# EAGLE design PointController (EAGLE 6.1)
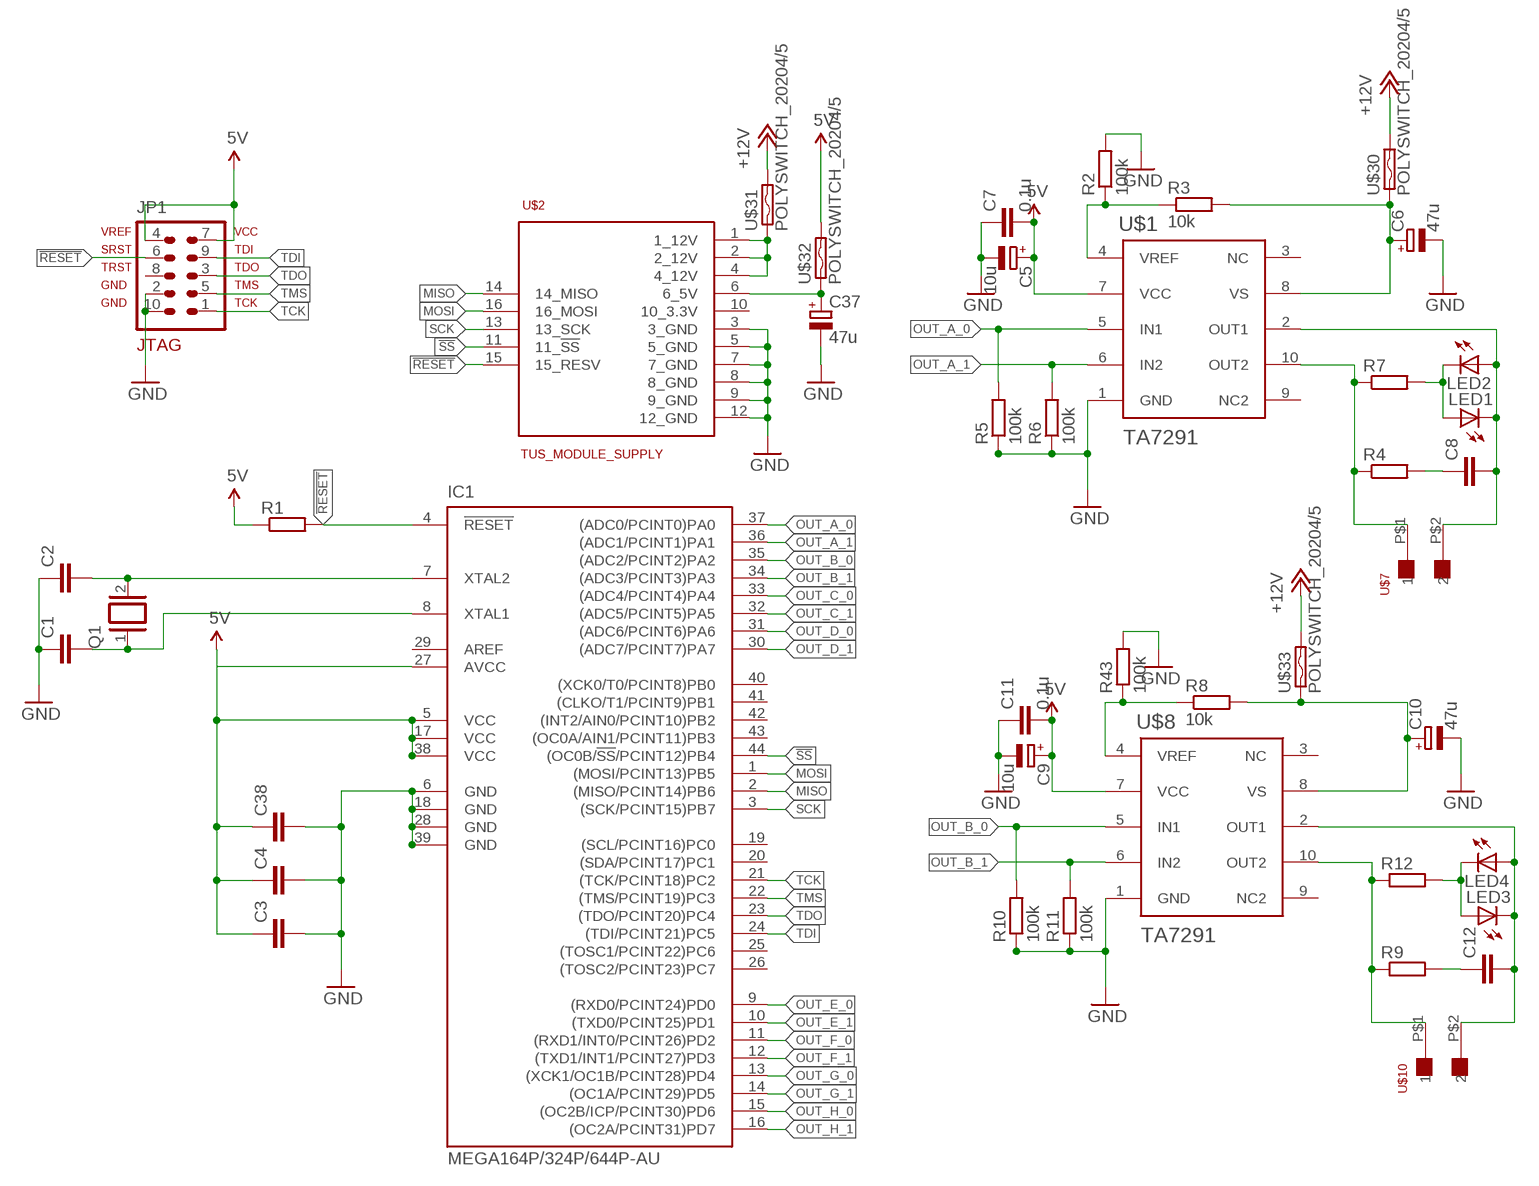
[diagram p0: schematic, sheet 1, part 1 of 2]
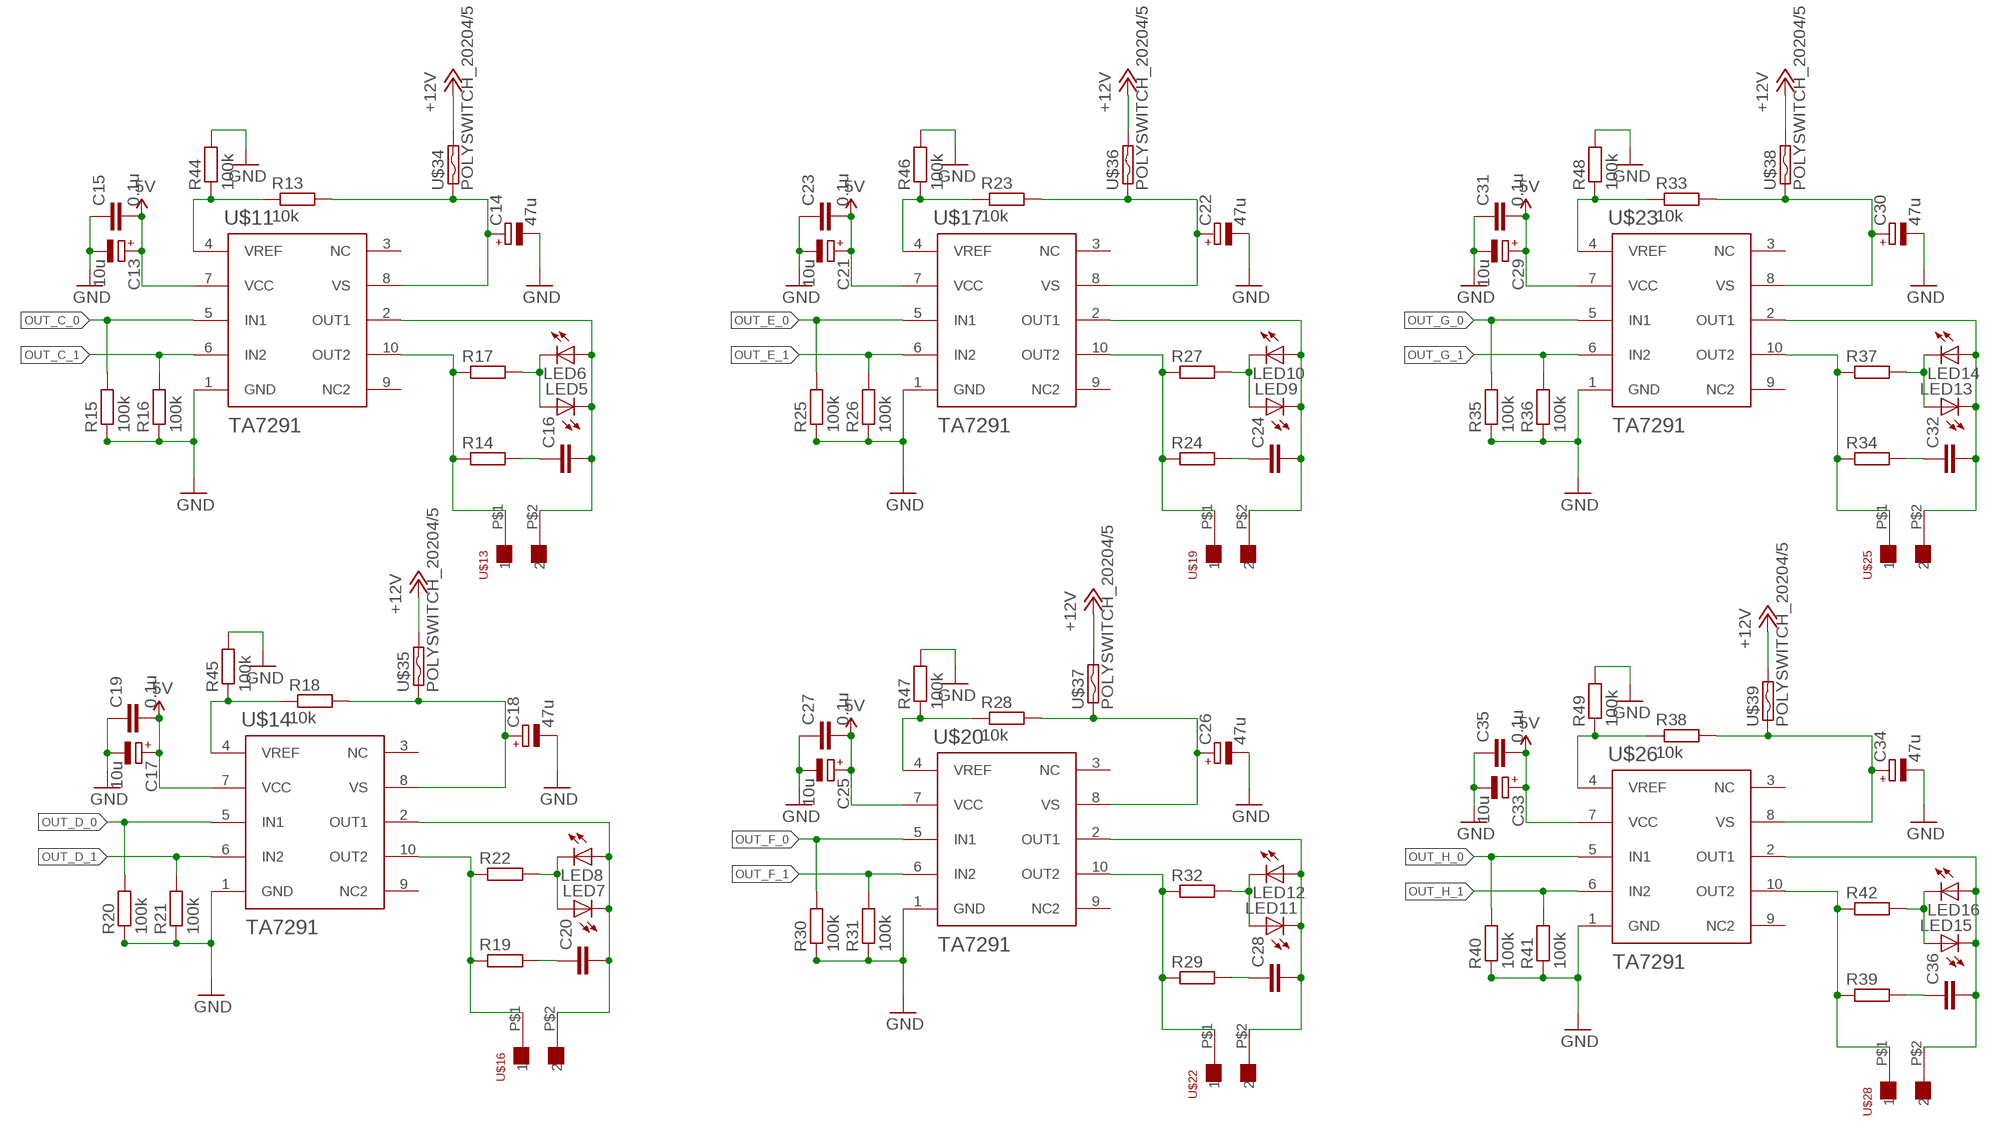
[diagram p1: schematic, sheet 1, part 2 of 2]

## Parts
C1  C-EUC1608  [C1608]
C2  C-EUC1608  [C1608]
C3  C-EUC1608  [C1608]
C4  C-EUC1608  [C1608]
C5  10u  CPOL-EUE1.8-4  [E1,8-4]
C6  47u  CPOL-EUE1.8-4  [E1,8-4]
C7  0.1u  C-EUC1608  [C1608]
C8  C5/3  [C5B3]
C9  10u  CPOL-EUE1.8-4  [E1,8-4]
C10  47u  CPOL-EUE1.8-4  [E1,8-4]
C11  0.1u  C-EUC1608  [C1608]
C12  C5/3  [C5B3]
C13  10u  CPOL-EUE1.8-4  [E1,8-4]
C14  47u  CPOL-EUE1.8-4  [E1,8-4]
C15  0.1u  C-EUC1608  [C1608]
C16  C5/3  [C5B3]
C17  10u  CPOL-EUE1.8-4  [E1,8-4]
C18  47u  CPOL-EUE1.8-4  [E1,8-4]
C19  0.1u  C-EUC1608  [C1608]
C20  C5/3  [C5B3]
C21  10u  CPOL-EUE1.8-4  [E1,8-4]
C22  47u  CPOL-EUE1.8-4  [E1,8-4]
C23  0.1u  C-EUC1608  [C1608]
C24  C5/3  [C5B3]
C25  10u  CPOL-EUE1.8-4  [E1,8-4]
C26  47u  CPOL-EUE1.8-4  [E1,8-4]
C27  0.1u  C-EUC1608  [C1608]
C28  C5/3  [C5B3]
C29  10u  CPOL-EUE1.8-4  [E1,8-4]
C30  47u  CPOL-EUE1.8-4  [E1,8-4]
C31  0.1u  C-EUC1608  [C1608]
C32  C5/3  [C5B3]
C33  10u  CPOL-EUE1.8-4  [E1,8-4]
C34  47u  CPOL-EUE1.8-4  [E1,8-4]
C35  0.1u  C-EUC1608  [C1608]
C36  C5/3  [C5B3]
C37  47u  CPOL-EUE1.8-4  [E1,8-4]
C38  C-EUC1608  [C1608]
IC1  MEGA164P/324P/644P-AU  [TQFP44]
JP1  AVR-JTAG-10  [AVR-JTAG-10]
LED1  LED3MM  [LED3MM]
LED2  LED3MM  [LED3MM]
LED3  LED3MM  [LED3MM]
LED4  LED3MM  [LED3MM]
LED5  LED3MM  [LED3MM]
LED6  LED3MM  [LED3MM]
LED7  LED3MM  [LED3MM]
LED8  LED3MM  [LED3MM]
LED9  LED3MM  [LED3MM]
LED10  LED3MM  [LED3MM]
LED11  LED3MM  [LED3MM]
LED12  LED3MM  [LED3MM]
LED13  LED3MM  [LED3MM]
LED14  LED3MM  [LED3MM]
LED15  LED3MM  [LED3MM]
LED16  LED3MM  [LED3MM]
Q1  XTAL/S  [QS]
R1  R-EU_R0603  [R0603]
R2  100k  R-EU_R0603  [R0603]
R3  10k  R-EU_R0603  [R0603]
R4  R-EU_0204/7  [0204/7]
R5  100k  R-EU_R0603  [R0603]
R6  100k  R-EU_R0603  [R0603]
R7  R-EU_0204/7  [0204/7]
R8  10k  R-EU_R0603  [R0603]
R9  R-EU_0204/7  [0204/7]
R10  100k  R-EU_R0603  [R0603]
R11  100k  R-EU_R0603  [R0603]
R12  R-EU_0204/7  [0204/7]
R13  10k  R-EU_R0603  [R0603]
R14  R-EU_0204/7  [0204/7]
R15  100k  R-EU_R0603  [R0603]
R16  100k  R-EU_R0603  [R0603]
R17  R-EU_0204/7  [0204/7]
R18  10k  R-EU_R0603  [R0603]
R19  R-EU_0204/7  [0204/7]
R20  100k  R-EU_R0603  [R0603]
R21  100k  R-EU_R0603  [R0603]
R22  R-EU_0204/7  [0204/7]
R23  10k  R-EU_R0603  [R0603]
R24  R-EU_0204/7  [0204/7]
R25  100k  R-EU_R0603  [R0603]
R26  100k  R-EU_R0603  [R0603]
R27  R-EU_0204/7  [0204/7]
R28  10k  R-EU_R0603  [R0603]
R29  R-EU_0204/7  [0204/7]
R30  100k  R-EU_R0603  [R0603]
R31  100k  R-EU_R0603  [R0603]
R32  R-EU_0204/7  [0204/7]
R33  10k  R-EU_R0603  [R0603]
R34  R-EU_0204/7  [0204/7]
R35  100k  R-EU_R0603  [R0603]
R36  100k  R-EU_R0603  [R0603]
R37  R-EU_0204/7  [0204/7]
R38  10k  R-EU_R0603  [R0603]
R39  R-EU_0204/7  [0204/7]
R40  100k  R-EU_R0603  [R0603]
R41  100k  R-EU_R0603  [R0603]
R42  R-EU_0204/7  [0204/7]
R43  100k  R-EU_R0603  [R0603]
R44  100k  R-EU_R0603  [R0603]
R45  100k  R-EU_R0603  [R0603]
R46  100k  R-EU_R0603  [R0603]
R47  100k  R-EU_R0603  [R0603]
R48  100k  R-EU_R0603  [R0603]
R49  100k  R-EU_R0603  [R0603]
U$1  TA7291  [HSIP10]
U$2  TUS_MODULE_SUPPLY  [2X08]
U$7  XH-2  [XH-2]
U$8  TA7291  [HSIP10]
U$10  XH-2  [XH-2]
U$11  TA7291  [HSIP10]
U$13  XH-2  [XH-2]
U$14  TA7291  [HSIP10]
U$16  XH-2  [XH-2]
U$17  TA7291  [HSIP10]
U$19  XH-2  [XH-2]
U$20  TA7291  [HSIP10]
U$22  XH-2  [XH-2]
U$23  TA7291  [HSIP10]
U$25  XH-2  [XH-2]
U$26  TA7291  [HSIP10]
U$28  XH-2  [XH-2]
U$30  POLYSWITCH_20204/5  [0204/5]
U$31  POLYSWITCH_20204/5  [0204/5]
U$32  POLYSWITCH_20204/5  [0204/5]
U$33  POLYSWITCH_20204/5  [0204/5]
U$34  POLYSWITCH_20204/5  [0204/5]
U$35  POLYSWITCH_20204/5  [0204/5]
U$36  POLYSWITCH_20204/5  [0204/5]
U$37  POLYSWITCH_20204/5  [0204/5]
U$38  POLYSWITCH_20204/5  [0204/5]
U$39  POLYSWITCH_20204/5  [0204/5]

## Nets
5V: C3.1 C4.1 C5.+ C7.2 C9.+ C11.2 C13.+ C15.2 C17.+ C19.2 C21.+ C23.2 C25.+ C27.2 C29.+ C31.2 C33.+ C35.2 C38.1 IC1.5(VCC) IC1.17(VCC) IC1.27(AVCC) IC1.38(VCC) JP1.4 JP1.7 R1.1 U$1.7(VCC) U$8.7(VCC) U$11.7(VCC) U$14.7(VCC) U$17.7(VCC) U$20.7(VCC) U$23.7(VCC) U$26.7(VCC) U$32.2
!RESET: IC1.4(!RESET) JP1.6 R1.2 U$2.15(15_RESV)
!SS: IC1.44((OC0B/!SS!/PCINT12)PB4) U$2.11(11_!SS)
+12V [12v]: U$30.2 U$31.2 U$33.2 U$34.2 U$35.2 U$36.2 U$37.2 U$38.2 U$39.2
GND: C1.1 C2.1 C3.2 C4.2 C5.- C6.- C7.1 C9.- C10.- C11.1 C13.- C14.- C15.1 C17.- C18.- C19.1 C21.- C22.- C23.1 C25.- C26.- C27.1 C29.- C30.- C31.1 C33.- C34.- C35.1 C37.- C38.2 IC1.6(GND) IC1.18(GND) IC1.28(GND) IC1.39(GND) JP1.2 JP1.10 R2.2 R5.1 R6.1 R10.1 R11.1 R15.1 R16.1 R20.1 R21.1 R25.1 R26.1 R30.1 R31.1 R35.1 R36.1 R40.1 R41.1 R43.2 R44.2 R45.2 R46.2 R47.2 R48.2 R49.2 U$1.1(GND) U$2.3(3_GND) U$2.5(5_GND) U$2.7(7_GND) U$2.8(8_GND) U$2.9(9_GND) U$2.12(12_GND) U$8.1(GND) U$11.1(GND) U$14.1(GND) U$17.1(GND) U$20.1(GND) U$23.1(GND) U$26.1(GND)
MISO: IC1.2((MISO/PCINT14)PB6) U$2.14(14_MISO)
MOSI: IC1.1((MOSI/PCINT13)PB5) U$2.16(16_MOSI)
N$1: LED1.A LED2.K(C) R7.2
N$2: R8.1 R43.1 U$8.4(VREF)
N$3: C1.2 IC1.8(XTAL1) Q1.1
N$4: C2.2 IC1.7(XTAL2) Q1.2
N$5 [12v]: C12.2 LED3.K(C) LED4.A U$8.2(OUT1) U$10.P$2
N$6: R2.1 R3.1 U$1.4(VREF)
N$7 [12v]: C8.2 LED1.K(C) LED2.A U$1.2(OUT1) U$7.P$2
N$8 [12v]: R4.1 R7.1 U$1.10(OUT2) U$7.P$1
N$9 [12v]: C8.1 R4.2
N$10 [12v]: R9.1 R12.1 U$8.10(OUT2) U$10.P$1
N$11 [12v]: C12.1 R9.2
N$12: LED3.A LED4.K(C) R12.2
N$13: R13.1 R44.1 U$11.4(VREF)
N$14 [12v]: C16.2 LED5.K(C) LED6.A U$11.2(OUT1) U$13.P$2
N$15 [12v]: R14.1 R17.1 U$11.10(OUT2) U$13.P$1
N$16 [12v]: C16.1 R14.2
N$17: LED5.A LED6.K(C) R17.2
N$18: R18.1 R45.1 U$14.4(VREF)
N$19 [12v]: C20.2 LED7.K(C) LED8.A U$14.2(OUT1) U$16.P$2
N$20 [12v]: R19.1 R22.1 U$14.10(OUT2) U$16.P$1
N$21 [12v]: C20.1 R19.2
N$22: LED7.A LED8.K(C) R22.2
N$23: R23.1 R46.1 U$17.4(VREF)
N$24 [12v]: C24.2 LED9.K(C) LED10.A U$17.2(OUT1) U$19.P$2
N$25 [12v]: R24.1 R27.1 U$17.10(OUT2) U$19.P$1
N$26 [12v]: C24.1 R24.2
N$27: LED9.A LED10.K(C) R27.2
N$28: R28.1 R47.1 U$20.4(VREF)
N$29 [12v]: C28.2 LED11.K(C) LED12.A U$20.2(OUT1) U$22.P$2
N$30 [12v]: R29.1 R32.1 U$20.10(OUT2) U$22.P$1
N$31 [12v]: C28.1 R29.2
N$32: LED11.A LED12.K(C) R32.2
N$33: R33.1 R48.1 U$23.4(VREF)
N$34 [12v]: C32.2 LED13.K(C) LED14.A U$23.2(OUT1) U$25.P$2
N$35 [12v]: R34.1 R37.1 U$23.10(OUT2) U$25.P$1
N$36 [12v]: C32.1 R34.2
N$37: LED13.A LED14.K(C) R37.2
N$38: R38.1 R49.1 U$26.4(VREF)
N$39 [12v]: C36.2 LED15.K(C) LED16.A U$26.2(OUT1) U$28.P$2
N$40 [12v]: R39.1 R42.1 U$26.10(OUT2) U$28.P$1
N$41 [12v]: C36.1 R39.2
N$42: LED15.A LED16.K(C) R42.2
N$43 [12v]: U$2.1(1_12V) U$2.2(2_12V) U$2.4(4_12V) U$31.1
N$44: C37.+ U$2.6(6_5V) U$32.1
N$45 [12v]: C6.+ R3.2 U$1.8(VS) U$30.1
N$46 [12v]: C14.+ R13.2 U$11.8(VS) U$34.1
N$47 [12v]: C22.+ R23.2 U$17.8(VS) U$36.1
N$48 [12v]: C30.+ R33.2 U$23.8(VS) U$38.1
N$49 [12v]: C34.+ R38.2 U$26.8(VS) U$39.1
N$50 [12v]: C26.+ R28.2 U$20.8(VS) U$37.1
N$51 [12v]: C18.+ R18.2 U$14.8(VS) U$35.1
N$52 [12v]: C10.+ R8.2 U$8.8(VS) U$33.1
OUT_A_0: IC1.37((ADC0/PCINT0)PA0) R5.2 U$1.5(IN1)
OUT_A_1: IC1.36((ADC1/PCINT1)PA1) R6.2 U$1.6(IN2)
OUT_B_0: IC1.35((ADC2/PCINT2)PA2) R10.2 U$8.5(IN1)
OUT_B_1: IC1.34((ADC3/PCINT3)PA3) R11.2 U$8.6(IN2)
OUT_C_0: IC1.33((ADC4/PCINT4)PA4) R15.2 U$11.5(IN1)
OUT_C_1: IC1.32((ADC5/PCINT5)PA5) R16.2 U$11.6(IN2)
OUT_D_0: IC1.31((ADC6/PCINT6)PA6) R20.2 U$14.5(IN1)
OUT_D_1: IC1.30((ADC7/PCINT7)PA7) R21.2 U$14.6(IN2)
OUT_E_0: IC1.9((RXD0/PCINT24)PD0) R25.2 U$17.5(IN1)
OUT_E_1: IC1.10((TXD0/PCINT25)PD1) R26.2 U$17.6(IN2)
OUT_F_0: IC1.11((RXD1/INT0/PCINT26)PD2) R30.2 U$20.5(IN1)
OUT_F_1: IC1.12((TXD1/INT1/PCINT27)PD3) R31.2 U$20.6(IN2)
OUT_G_0: IC1.13((XCK1/OC1B/PCINT28)PD4) R35.2 U$23.5(IN1)
OUT_G_1: IC1.14((OC1A/PCINT29)PD5) R36.2 U$23.6(IN2)
OUT_H_0: IC1.15((OC2B/ICP/PCINT30)PD6) R40.2 U$26.5(IN1)
OUT_H_1: IC1.16((OC2A/PCINT31)PD7) R41.2 U$26.6(IN2)
SCK: IC1.3((SCK/PCINT15)PB7) U$2.13(13_SCK)
TCK: IC1.21((TCK/PCINT18)PC2) JP1.1
TDI: IC1.24((TDI/PCINT21)PC5) JP1.9
TDO: IC1.23((TDO/PCINT20)PC4) JP1.3
TMS: IC1.22((TMS/PCINT19)PC3) JP1.5
Unconnected: IC1.19((SCL/PCINT16)PC0) IC1.20((SDA/PCINT17)PC1) IC1.25((TOSC1/PCINT22)PC6) IC1.26((TOSC2/PCINT23)PC7) IC1.40((XCK0/T0/PCINT8)PB0) IC1.41((CLKO/T1/PCINT9)PB1) IC1.42((INT2/AIN0/PCINT10)PB2) IC1.43((OC0A/AIN1/PCINT11)PB3) JP1.8 U$1.3(NC) U$1.9(NC2) U$2.10(10_3.3V) U$8.3(NC) U$8.9(NC2) U$11.3(NC) U$11.9(NC2) U$14.3(NC) U$14.9(NC2) U$17.3(NC) U$17.9(NC2) U$20.3(NC) U$20.9(NC2) U$23.3(NC) U$23.9(NC2) U$26.3(NC) U$26.9(NC2)

## Power pins joined to a net without a drawn wire
AREF: IC1.29(AREF)

## Library data of the parts
C1-C4 C7 C11 C15 C19 C23 C27 C31 C35 C38 = rcl:C-EU: CAPACITOR, European symbol
C5 C6 C9 C10 C13 C14 C17 C18 C21 C22 C25 C26 C29 C30 C33 C34 C37 = resistor:CPOL-EU: POLARIZED CAPACITOR, European symbol
C8 C12 C16 C20 C24 C28 C32 C36 = capacitor-wima:C: CAPACITOR naming: grid - package width
IC1 = avr-7:MEGA164P/324P/644P-AU
JP1 = avr-7:AVR-JTAG-10: AVR JTAG Debug/Programming Header
LED1-LED16 = led:LED: LED OSRAM: - CHIPLED LG R971, LG N971, LY N971, LG Q971, LY Q971, LO R971, LY R971 LH N974, LH R974 LS Q976, LO Q976, LY Q976 LO Q996 - Hyper CHIPLED LW Q18S LB Q993, LB Q99A, LB R99A - SideLED LS A670, LO A670, LY A670, LG A670, LP A670 LB A673, LV A673, LT A673, LW A673 LH A674 LY A675 LS A676, LA A676, LO A676, LY A676, LW A676 LS A679, LY A679, LG A679 - Hyper Micro SIDELED® LS Y876, LA Y876, LO Y876, LY Y876 LT Y87S - SmartLED LW L88C, LW L88S LB L89C, LB L89S, LG L890 LS L89K, LO L89K, LY L89K LS L896, LA L896, LO L896, LY L896 - TOPLED LS T670, LO T670, LY T670, LG T670, LP T670 LSG T670, LSP T670, LSY T670, LOP T670, LYG T670 LG T671, LOG T671, LSG T671 LB T673, LV T673, LT T673, LW T673 LH T674 LS T676, LA T676, LO T676, LY T676, LB T676, LH T676, LSB T676, LW T676 LB T67C, LV T67C, LT T67C, LS T67K, LO T67K, LY T67K, LW E67C LS E67B, LA E67B, LO E67B, LY E67B, LB E67C, LV E67C, LT E67C LW T67C LS T679, LY T679, LG T679 LS T770, LO T770, LY T770, LG T770, LP T770 LB T773, LV T773, LT T773, LW T773 LH T774 LS E675, LA E675, LY E675, LS T675 LS T776, LA T776, LO T776, LY T776, LB T776 LHGB T686 LT T68C, LB T68C - Hyper Mini TOPLED® LB M676 - Mini TOPLED Santana® LG M470 LS M47K, LO M47K, LY M47K Source: http://www.osram.convergy.de LUXEON: - LUMILED® LXK2-PW12-R00, LXK2-PW12-S00, LXK2-PW14-U00, LXK2-PW14-V00 LXK2-PM12-R00, LXK2-PM12-S00, LXK2-PM14-U00 LXK2-PE12-Q00, LXK2-PE12-R00, LXK2-PE12-S00, LXK2-PE14-T00, LXK2-PE14-U00 LXK2-PB12-K00, LXK2-PB12-L00, LXK2-PB12-M00, LXK2-PB14-N00, LXK2-PB14-P00, LXK2-PB14-Q00 LXK2-PR12-L00, LXK2-PR12-M00, LXK2-PR14-Q00, LXK2-PR14-R00 LXK2-PD12-Q00, LXK2-PD12-R00, LXK2-PD12-S00 LXK2-PH12-R00, LXK2-PH12-S00 LXK2-PL12-P00, LXK2-PL12-Q00, LXK2-PL12-R00 Source: www.luxeon.com KINGBRIGHT: KA-3528ASYC Source: www.kingbright.com
Q1 = special:XTAL/S: CRYSTAL
R1-R3 R5 R6 R8 R10 R11 R13 R15 R16 R18 R20 R21 R23 R25 R26 R28 R30 R31 R33 R35 R36 R38 R40 R41 R43-R49 = rcl:R-EU_: RESISTOR, European symbol
R4 R7 R9 R12 R14 R17 R19 R22 R24 R27 R29 R32 R34 R37 R39 R42 = resistor:R-EU_: RESISTOR, European symbol
U$1 U$8 U$11 U$14 U$17 U$20 U$23 U$26 = TA7291P:TA7291
U$2 = myparts:TUS_MODULE_SUPPLY
U$7 U$10 U$13 U$16 U$19 U$22 U$25 U$28 = myparts:XH-2
U$30-U$39 = myparts:POLYSWITCH_2

## Net classes
1 12v: width 0.508 mm, clearance 0.254 mm

## Board
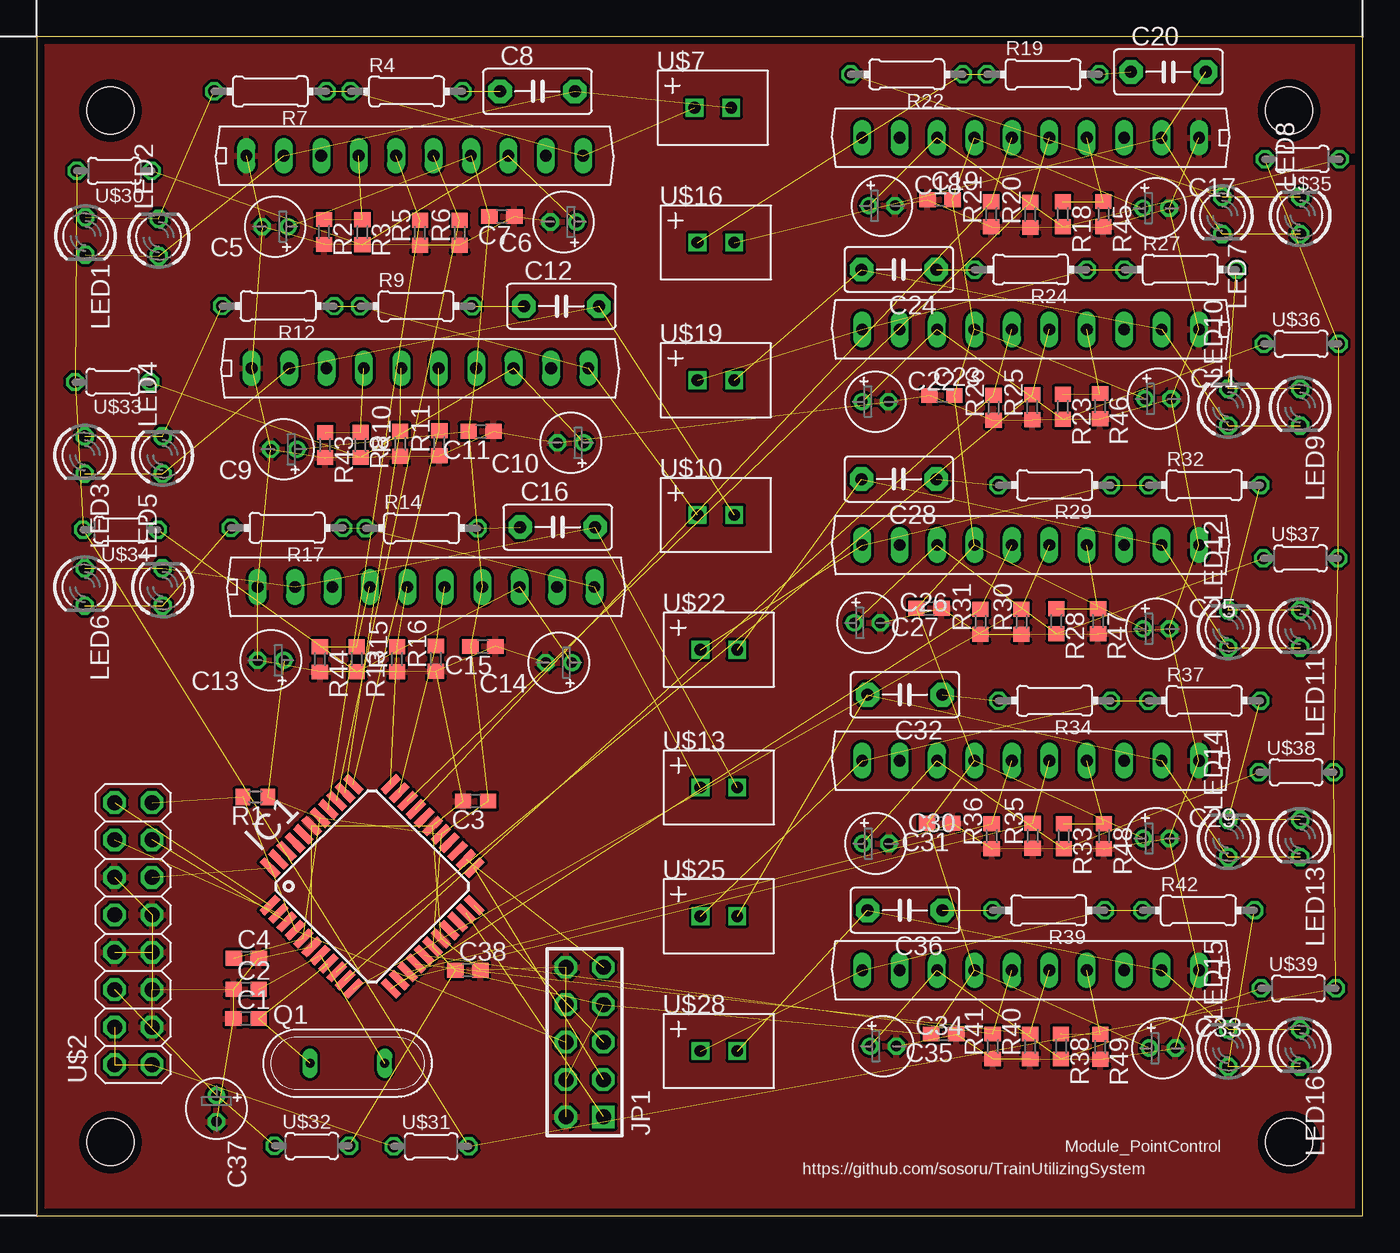
[diagram p2: board, top side]
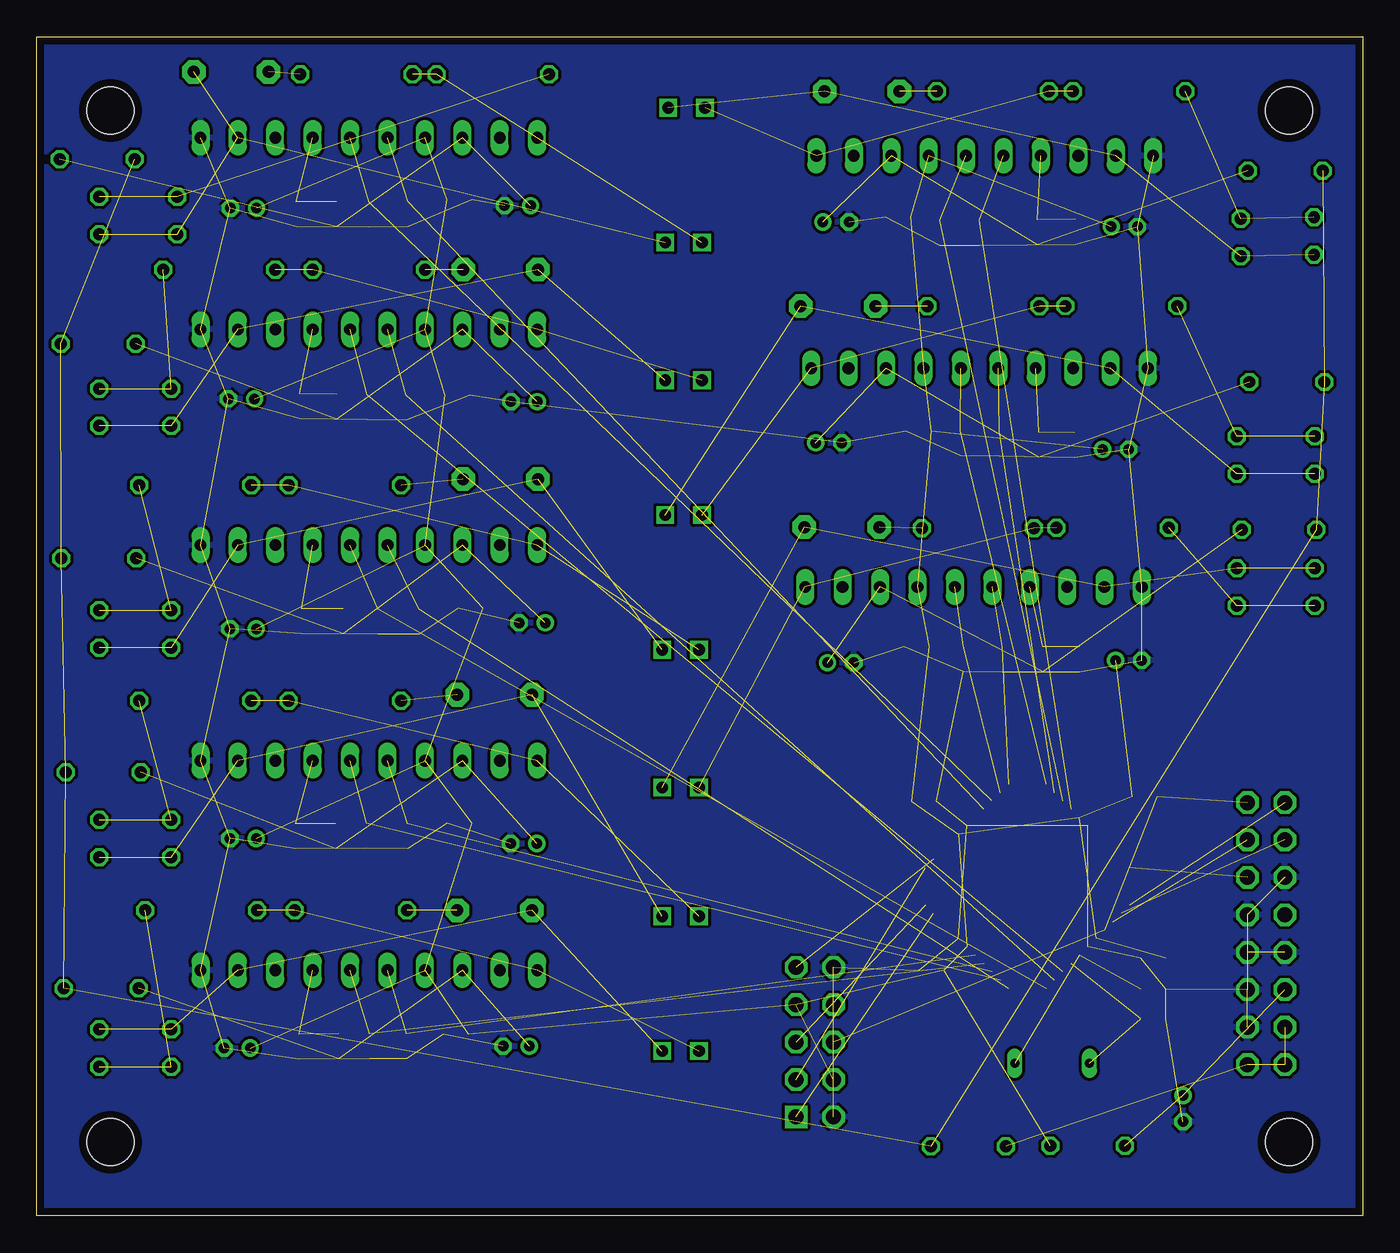
[diagram p3: board, bottom side, seen from below]

Size 90 x 80 mm. Coordinates in mm from the lower left corner, seen from the top.
Outline: 0,0 90,0 90,80 0,80 0,0
Copper layers (1*16): Top 0.035mm / dielectric 1.5mm / Bottom 0.035mm
Design rules: minimum track width 8mil, minimum drill 0.4mm, track to track 8mil, track to pad 8mil, pad to pad 8mil, via to via 8mil, smd to smd 8mil, copper to edge 20mil, drill to drill 8mil, minimum pad ring 8mil, minimum via ring 10mil, stop-mask expansion 3mil, vias tented up to drill 0mil, thermal gap 8mil
Holes 3.2 mm at 5,75 5,5 85,5 85,75
vRestrict: area 51,1.5 to 84.4,17.2

### Footprints (pad centres in the part's own frame; a part is rotated, then mirrored left to right if it is on the bottom)
C1608 = smd 1.1 x 1: 1 -0.85,0; 2 0.85,0
E1,8-4 = drill 0.711 pad 1.168: + -0.889,0 | drill 0.711 pad 1.168 octagon: - 0.889,0
C5B3 = drill 0.813 pad 1.6 octagon: 1 -2.54,0; 2 2.54,0
TQFP44 = smd 1.5 x 0.5: 1 -5.8,4; 2 -5.8,3.2; 3 -5.8,2.4; 4 -5.8,1.6; 5 -5.8,0.8; 6 -5.8,0; 7 -5.8,-0.8; 8 -5.8,-1.6; 9 -5.8,-2.4; 10 -5.8,-3.2; 11 -5.8,-4; 23 5.8,-4; 24 5.8,-3.2; 25 5.8,-2.4; 26 5.8,-1.6; 27 5.8,-0.8; 28 5.8,0; 29 5.8,0.8; 30 5.8,1.6; 31 5.8,2.4; 32 5.8,3.2; 33 5.8,4 | smd 0.5 x 1.5: 12 -4,-5.8; 13 -3.2,-5.8; 14 -2.4,-5.8; 15 -1.6,-5.8; 16 -0.8,-5.8; 17 0,-5.8; 18 0.8,-5.8; 19 1.6,-5.8; 20 2.4,-5.8; 21 3.2,-5.8; 22 4,-5.8; 34 4,5.8; 35 3.2,5.8; 36 2.4,5.8; 37 1.6,5.8; 38 0.8,5.8; 39 0,5.8; 40 -0.8,5.8; 41 -1.6,5.8; 42 -2.4,5.8; 43 -3.2,5.8; 44 -4,5.8
AVR-JTAG-10 = drill 1.016 square: 1 -5.08,-1.27 | drill 1.016 octagon: 2 -5.08,1.27; 3 -2.54,-1.27; 4 -2.54,1.27; 5 0,-1.27; 6 0,1.27; 7 2.54,-1.27; 8 2.54,1.27; 9 5.08,-1.27; 10 5.08,1.27
LED3MM = drill 0.813 octagon: A -1.27,0; K 1.27,0
QS = drill 0.61 long: 1 -2.54,0; 2 2.54,0
R0603 = smd 1 x 1.1: 1 -0.85,0; 2 0.85,0
0204/7 = drill 0.813 octagon: 1 -3.81,0; 2 3.81,0
HSIP10 = drill 0.8 long: 1 -11.43,0; 2 -8.89,0; 3 -6.35,0; 4 -3.81,0; 5 -1.27,0; 6 1.27,0; 7 3.81,0; 8 6.35,0; 9 8.89,0; 10 11.43,0
2X08 = drill 1.016 octagon: 1 -8.89,-1.27; 2 -8.89,1.27; 3 -6.35,-1.27; 4 -6.35,1.27; 5 -3.81,-1.27; 6 -3.81,1.27; 7 -1.27,-1.27; 8 -1.27,1.27; 9 1.27,-1.27; 10 1.27,1.27; 11 3.81,-1.27; 12 3.81,1.27; 13 6.35,-1.27; 14 6.35,1.27; 15 8.89,-1.27; 16 8.89,1.27
XH-2 = drill 0.8 square: P$1 -2.5,0; P$2 0,0
0204/5 = drill 0.813 octagon: 1 -2.54,0; 2 2.54,0

### Placement (x,y rotation side)
C1  14.2,13.39 0 top
C2  14.21,15.37 0 top
C3  29.78,28.14 180 top
C4  14.22,17.48 0 top
C5  16.18,67.12 180 top
C6  35.75,67.44 180 top
C7  31.56,67.81 180 top
C8  33.99,76.3 0 top
C9  16.76,52.01 180 top
C10  36.25,52.45 180 top
C11  30.15,53.24 180 top
C12  35.61,61.72 0 top
C13  15.89,37.69 180 top
C14  35.43,37.53 180 top
C15  30.28,38.63 180 top
C16  35.36,46.74 0 top
C17  75.97,68.38 0 top
C18  57.37,68.54 0 top
C19  61.32,68.95 0 top
C20  76.81,77.62 0 top
C21  76.11,55.44 0 top
C22  56.92,55.24 0 top
C23  61.44,55.66 0 top
C24  58.52,64.21 180 top
C25  76,39.83 0 top
C26  56.38,40.23 0 top
C27  60.57,41.22 180 top
C28  58.52,49.99 180 top
C29  76,25.6 0 top
C30  56.95,25.26 0 top
C31  61.29,26.63 180 top
C32  58.93,35.36 180 top
C33  76.4,11.38 0 top
C34  57.45,11.51 0 top
C35  61.56,12.33 180 top
C36  58.93,20.73 180 top
C37  12.19,7.28 270 top
C38  29.26,16.66 0 top
IC1  22.76,22.35 45 top
JP1  37.19,11.79 90 top
LED1  3.3,66.5 270 top
LED2  8.28,66.4 90 top
LED3  3.25,51.61 270 top
LED4  8.53,51.61 90 top
LED5  8.53,42.67 90 top
LED6  3.25,42.67 270 top
LED7  80.47,67.87 270 top
LED8  85.75,67.87 90 top
LED9  85.75,54.86 270 top
LED10  80.87,54.86 90 top
LED11  85.75,39.83 270 top
LED12  80.87,39.83 90 top
LED13  85.75,25.6 270 top
LED14  80.87,25.6 90 top
LED15  80.87,11.38 90 top
LED16  85.75,11.38 270 top
Q1  21.08,10.35 0 top
R1  14.83,28.42 180 top
R2  19.49,66.76 270 top
R3  22.1,66.74 270 top
R4  25.1,76.3 0 top
R5  26.01,66.7 90 top
R6  28.7,66.7 90 top
R7  15.85,76.3 180 top
R8  21.97,52.31 270 top
R9  25.74,61.72 0 top
R10  24.66,52.39 90 top
R11  27.32,52.43 90 top
R12  16.38,61.73 180 top
R13  21.72,37.77 270 top
R14  26.12,46.66 0 top
R15  24.45,37.77 90 top
R16  27.09,37.81 90 top
R17  16.98,46.69 180 top
R18  69.65,67.96 270 top
R19  68.31,77.46 0 top
R20  67.44,67.92 90 top
R21  64.78,67.96 90 top
R22  59.05,77.46 180 top
R23  69.65,54.9 270 top
R24  67.46,64.21 180 top
R25  67.58,54.86 90 top
R26  64.95,54.83 90 top
R27  77.62,64.21 0 top
R28  69.2,40.35 270 top
R29  69.09,49.58 180 top
R30  66.84,40.31 90 top
R31  64.06,40.31 90 top
R32  79.25,49.58 0 top
R33  69.71,25.76 270 top
R34  69.09,34.95 180 top
R35  67.6,25.79 90 top
R36  64.82,25.76 90 top
R37  79.25,34.95 0 top
R38  69.52,11.49 270 top
R39  68.68,20.73 180 top
R40  67.42,11.49 90 top
R41  64.88,11.49 90 top
R42  78.84,20.73 0 top
R43  19.57,52.3 270 top
R44  19.22,37.76 270 top
R45  72.4,67.97 270 top
R46  72.17,54.94 270 top
R47  72.03,40.35 270 top
R48  72.44,25.76 270 top
R49  72.19,11.47 270 top
U$1  25.65,71.93 0 top
U$2  6.55,19.15 90 top
U$7  47.14,75.18 0 top
U$8  26.01,57.51 0 top
U$10  47.35,47.55 0 top
U$11  26.42,42.67 0 top
U$13  47.55,29.06 0 top
U$14  67.46,73.15 180 top
U$16  47.35,66.04 0 top
U$17  67.46,60.15 180 top
U$19  47.35,56.69 0 top
U$20  67.46,45.52 180 top
U$22  47.55,38.4 0 top
U$23  67.46,30.89 180 top
U$25  47.55,20.32 0 top
U$26  67.46,16.66 180 top
U$28  47.55,11.18 0 top
U$30  5.26,70.9 180 top
U$31  26.77,4.71 0 top
U$32  18.67,4.74 0 top
U$33  5.14,56.58 180 top
U$34  5.68,46.56 180 top
U$35  85.9,71.7 180 top
U$36  85.83,59.17 0 top
U$37  85.79,44.62 0 top
U$38  85.48,30.1 0 top
U$39  85.64,15.43 0 top

### Tracks (layer width: path | path; a pad name or v marks a point on that pad's centre or on a via)
5V  (34 unrouted)
!RESET  (3 unrouted)
!SS  (1 unrouted)
+12V  (8 unrouted)
GND  (73 unrouted)
  pour Bottom: -1.22,80.87 -1.22,-1.22 91.85,-1.22 91.85,81.28 -1.22,81.28
  pour Top: -2.44,82.5 -2.44,-3.25 93.88,-3.25 93.88,82.91 -2.44,82.91
MISO  (1 unrouted)
MOSI  (1 unrouted)
N$1  (2 unrouted)
N$2  (2 unrouted)
N$3  (2 unrouted)
N$4  (2 unrouted)
N$5  (4 unrouted)
N$6  (2 unrouted)
N$7  (4 unrouted)
N$8  (3 unrouted)
N$9  (1 unrouted)
N$10  (3 unrouted)
N$11  (1 unrouted)
N$12  (2 unrouted)
N$13  (2 unrouted)
N$14  (4 unrouted)
N$15  (3 unrouted)
N$16  (1 unrouted)
N$17  (2 unrouted)
N$18  (2 unrouted)
N$19  (4 unrouted)
N$20  (3 unrouted)
N$21  (1 unrouted)
N$22  (2 unrouted)
N$23  (2 unrouted)
N$24  (4 unrouted)
N$25  (3 unrouted)
N$26  (1 unrouted)
N$27  (2 unrouted)
N$28  (2 unrouted)
N$29  (4 unrouted)
N$30  (3 unrouted)
N$31  (1 unrouted)
N$32  (2 unrouted)
N$33  (2 unrouted)
N$34  (4 unrouted)
N$35  (3 unrouted)
N$36  (1 unrouted)
N$37  (2 unrouted)
N$38  (2 unrouted)
N$39  (4 unrouted)
N$40  (3 unrouted)
N$41  (1 unrouted)
N$42  (2 unrouted)
N$43  (3 unrouted)
N$44  (2 unrouted)
N$45  (3 unrouted)
N$46  (3 unrouted)
N$47  (3 unrouted)
N$48  (3 unrouted)
N$49  (3 unrouted)
N$50  (3 unrouted)
N$51  (3 unrouted)
N$52  (3 unrouted)
OUT_A_0  (2 unrouted)
OUT_A_1  (2 unrouted)
OUT_B_0  (2 unrouted)
OUT_B_1  (2 unrouted)
OUT_C_0  (2 unrouted)
OUT_C_1  (2 unrouted)
OUT_D_0  (2 unrouted)
OUT_D_1  (2 unrouted)
OUT_E_0  (2 unrouted)
OUT_E_1  (2 unrouted)
OUT_F_0  (2 unrouted)
OUT_F_1  (2 unrouted)
OUT_G_0  (2 unrouted)
OUT_G_1  (2 unrouted)
OUT_H_0  (2 unrouted)
OUT_H_1  (2 unrouted)
SCK  (1 unrouted)
TCK  (1 unrouted)
TDI  (1 unrouted)
TDO  (1 unrouted)
TMS  (1 unrouted)

### Text on the board
tNames: Module_PointControl | https://github.com/sosoru/TrainUtilizingSystem